# Altium project OGS_Headstage.PrjPcb
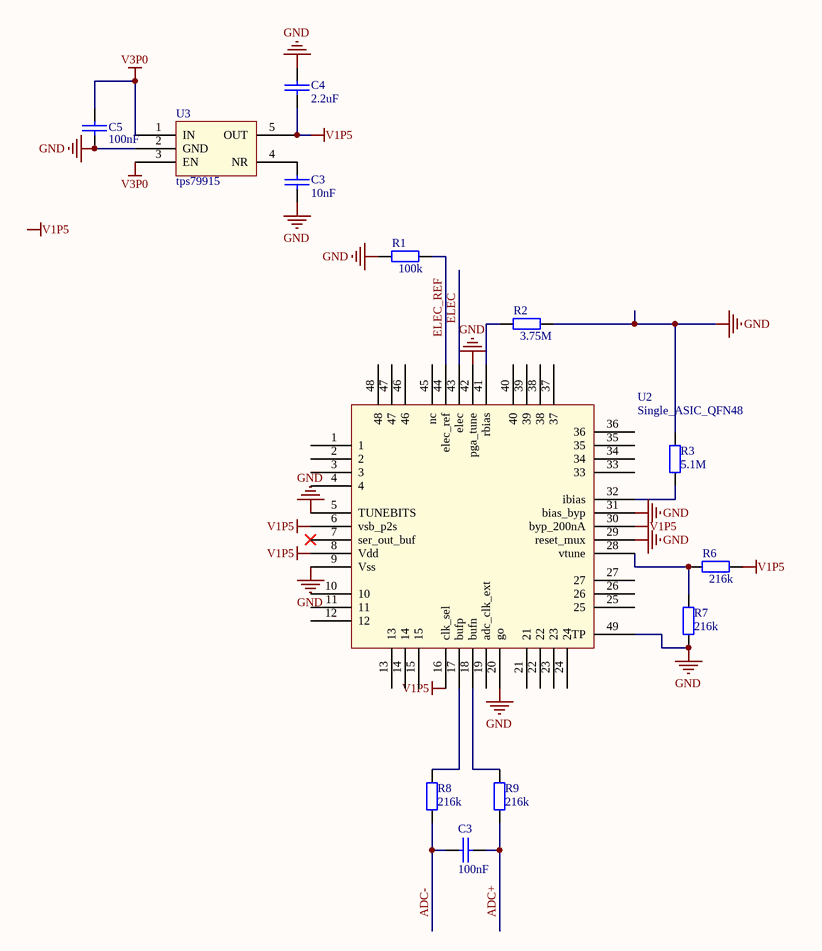
[diagram p0: SingleASIC.SchDoc]
4 sheets, 55 parts. Net scope: global (net labels, ports and power ports of the same name join across sheets).
Board file: OGS_Headstage.PcbDoc
Sheets:
  SingleASIC.SchDoc
  Main_4x4.SchDoc
  LED_SOP.SchDoc
  RF_POWER.SchDoc

## Sheet SingleASIC.SchDoc
size A

### Parts
(Parts that share a designator on the sheet are numbered #1, #2 ... from top to bottom, then left to right.)
C3#1  value 10nF  [0402s]  (hidden comment: NP0 50V)
C3#2  value 100nF  [0402s]  (hidden comment: NP0 50V)
C4#1  value 2.2uF  [0402s]  (hidden comment: NP0 50V)
C5#1  value 100nF  [0402s]  (hidden comment: NP0 50V)
R1  value 100k  [0402s]  (hidden comment: Res2)
R2  value 3.75M  [0402s]  (hidden comment: Res2)
R3  value 5.1M  [0402s]  (hidden comment: Res2)
R6  value 216k  [0402s]  (hidden comment: Res2)
R7  value 216k  [0402s]  (hidden comment: Res2)
R8  value 216k  [0402s]  (hidden comment: Res2)
R9  value 216k  [0402s]  (hidden comment: Res2)
U2  Single_ASIC_QFN48  [Single_ASIC]
U3#1  tps79915  [SOT23-5AN]

### Nets
GND: C3#1.1 C4#1.2 C5#1.1 R1.1 R2.2 R3.2 R7.1 U2.5(TUNEBITS) U2.9(Vss) U2.20(go) U2.29(reset_mux) U2.31(bias_byp) U2.42(pga_tune) U2.49(TP) U3#1.2(GND)
V1P5: C4#1.1 R6.2 U2.6(vsb_p2s) U2.8(Vdd) U2.16(clk_sel) U2.30(byp_200nA) U3#1.5(OUT)
V3P0: C5#1.2 U3#1.1(IN) U3#1.3(EN)
ADC+: C3#2.1 R9.1
ADC-: C3#2.2 R8.1
ELEC: U2.43(elec)
ELEC_REF: R1.2 U2.44(elec_ref)
NetC3#1_2: C3#1.2 U3#1.4(NR)
NetR2_1: R2.1 U2.41(rbias)
NetR3_1: R3.1 U2.32(ibias)
NetR6_1: R6.1 R7.2 U2.28(vtune)
NetR8_2: R8.2 U2.17(bufp)
NetR9_2: R9.2 U2.18(bufn)

Not connected (* = marked no-connect by the designer): U2 1 2 3 4 7(ser_out_buf)* 10 11 12 13 14 15 19(adc_clk_ext) 21 22 23 24 25 26 27 33 34 35 36 37 38 39 40 45(nc) 46 47 48

### Notes on the sheet
- Labels drawn without touching a wire or pin: V1P5

### Library data of the parts
C3#1 C3#2 C4#1 C5#1 = Cap: Capacitor; Part Field 1: 0402
R1-R3 R6-R9 = Res2: Resistor; Published: 8-Jun-2000; LatestRevisionDate: 17-Jul-2002; LatestRevisionNote: Re-released for DXP Platform.; PackageReference: AXIAL-0.4; Publisher: Altium Limited; PackageDescription: Axial Device, Thru-Hole; 2 Leads; 0.4 in Pin Spacing

## Sheet Main_4x4.SchDoc
size A
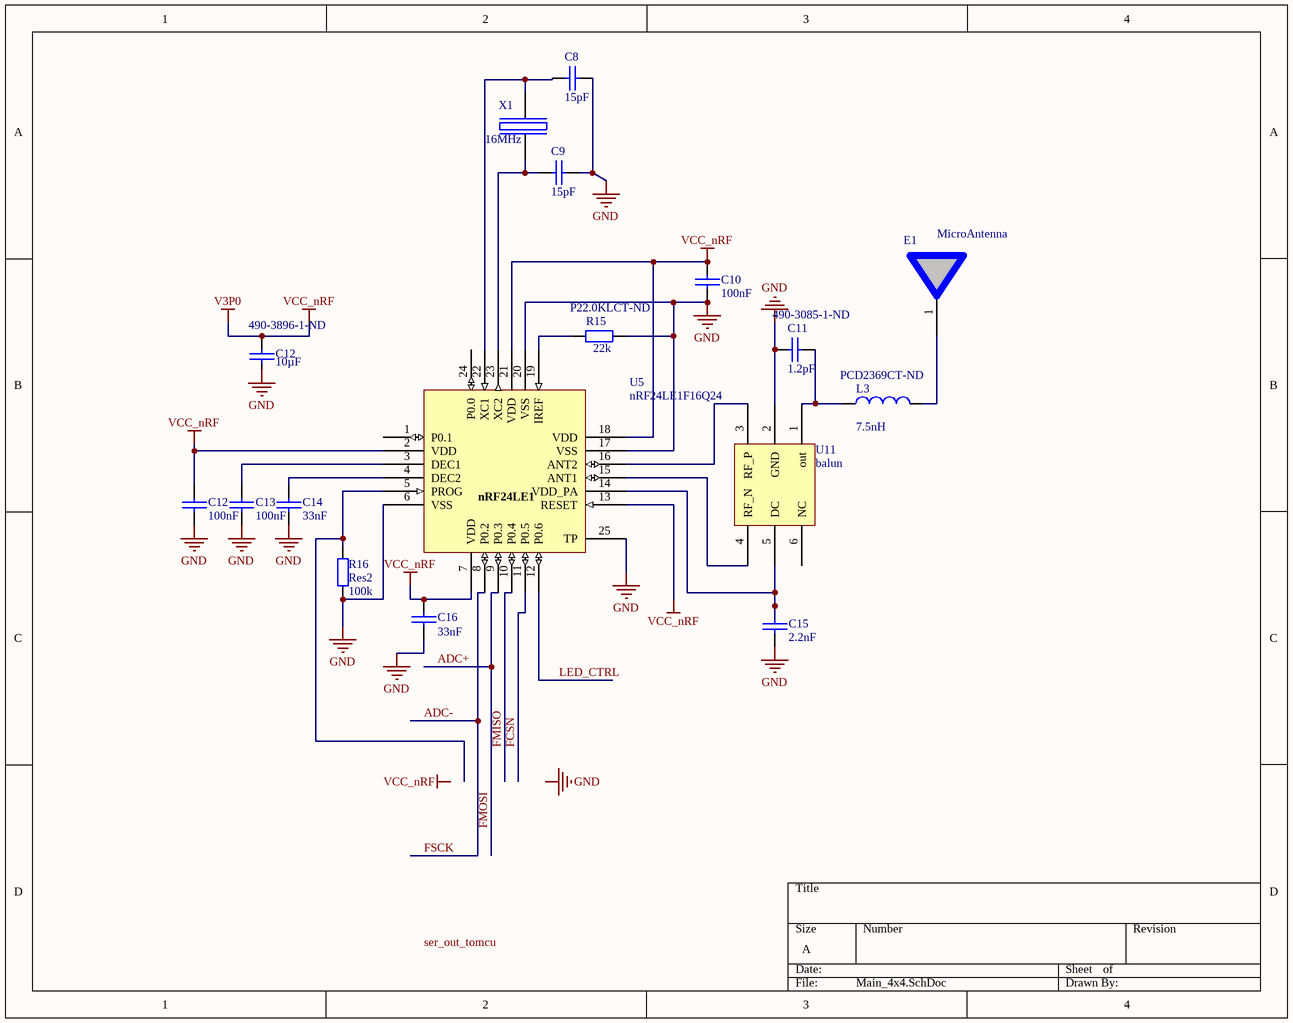
[diagram p1: Main_4x4.SchDoc]

### Parts
(Parts that share a designator on the sheet are numbered #1, #2 ... from top to bottom, then left to right.)
C8  value 15pF  [0402s]  (hidden comment: NP0 50V)
C9  value 15pF  [0402s]  (hidden comment: NP0 50V)
C10  value 100nF  [0402s]  (hidden comment: NP0 50V)
C11  value 1.2pF  Supplier Part Number 1: 490-3085-1-ND  [0402s]  (hidden comment: NP0 50V)
C12#1  Supplier Part Number 1: 490-3896-1-ND  Capacitance: 10µF  [0402s]  (hidden comment: NP0 50V)
C12#2  value 100nF  [0402s]  (hidden comment: NP0 50V)
C13  value 100nF  [0402s]  (hidden comment: NP0 50V)
C14  value 33nF  [0402s]  (hidden comment: NP0 50V)
C15  value 2.2nF  [0402s]  (hidden comment: NP0 50V)
C16  value 33nF  [0402s]  (hidden comment: NP0 50V)
E1#1  MicroAntenna  [microantenna]
L3  value 7.5nH  Supplier Part Number 1: PCD2369CT-ND  [0402-A]  (hidden comment: Inductor)
R15  value 22k  Supplier Part Number 1: P22.0KLCT-ND  [0402s]  (hidden comment: Res2)
R16  Res2  value 100k  [0402s]
U5  value nRF24LE1F16Q24  [NORDIC_QFN50P400X400X90-25N]  (hidden comment: QFN24 4x4 package)
U11  balun  [balun]
X1  value 16MHz  [bt-xtal 2.5 x 2 mm]  (hidden comment: TSX-3225, 16MHz, Cl=9pF, +/-10ppm)

### Nets
GND: C8.1 C9.2 C10.2 C11.1 C12#2.2 C13.1 C14.2 C15.2 C16.1 R15.2 R16.1 U5.6(VSS) U5.17(VSS) U5.20(VSS) U5.25(TP) U11.2(GND) X1.2(GND) X1.4(GND)
V3P0: C10.1 C12#1.1 C12#2.1 C16.2 U5.2(VDD) U5.7(VDD) U5.13(RESET) U5.18(VDD) U5.21(VDD)  [also labelled VCC_nRF]
ADC+: U5.9(P0.3)  [also labelled FMOSI]
ADC-: U5.8(P0.2)  [also labelled FSCK]
FCSN: U5.11(P0.5)
FMISO: U5.10(P0.4)
LED_CTRL: U5.12(P0.6)
NetC8_2: C8.2 U5.22(XC1) X1.3(out)
NetC9_1: C9.1 U5.23(XC2) X1.1(inp)
NetC11_2: C11.2 L3.1 U11.1(out)
NetC13_2: C13.2 U5.3(DEC1)
NetC14_1: C14.1 U5.4(DEC2)
NetC15_1: C15.1 U5.14(VDD_PA) U11.5(DC)
NetE1#1_1: E1#1.1 L3.2
NetR15_1: R15.1 U5.19(IREF)
NetR16_2: R16.2 U5.5(PROG)
NetU5_15: U5.15(ANT1) U11.4(RF_N)
NetU5_16: U5.16(ANT2) U11.3(RF_P)

Not connected (* = marked no-connect by the designer): C12#1 2; E1#1 2; U5 1(P0.1) 24(P0.0); U11 6(NC)

### Notes on the sheet
- Labels drawn without touching a wire or pin: GND, ser_out_tomcu, VCC_nRF
- (in symbol nRF24LE1 - 4x4) nRF24LE1

### Library data of the parts
C8-C10 C12#2 C13 C14 C16 = Cap: Capacitor; Part Field 1: 0402
C11 = Cap: Capacitor; Part Field 1: 0402; Manufacturer: Murata Electronics North America; Manufacturer Part Number: GJM1555C1H1R2CB01D; Description: CAP CERAMIC 1.2PF 50V C0G 0402; Tolerance: ±0.25pF; Temperature Coefficient: C0G, NP0; Supplier 1: Digi-Key; RoHS: RoHS Compliant; Category: Capacitors; Stock 1: 74898; Pricing 1: 1=0.23, 10=0.143, 50=0.0686, 100=0.0515, 250=0.0372, 500=0.02746, 1000=0.01859 (USD); Capacitance: 1.2pF; Voltage - Rated: 50V; Mounting Type: Surface Mount, MLCC; Operating Temperature: -55°C ~ 125°C; Applications: RF, Microwave, High Frequency; Ratings: -; Package / Case: 0402 (1005 Metric); Size / Dimension: 0.039" L x 0.020" W (1.00mm x 0.50mm); Height: -; Thickness: 0.022" (0.55mm); Lead Spacing: -; Features: High Q, Low Loss; Packaging: Cut Tape (CT); Lead Style: -; ComponentLink1URL: http://search.murata.co.jp/Ceramy/image/img/PDF/ENG/GJM1555C1H1R2CB01.pdf; ComponentLink1Description: http://search.murata.co.jp/Ceramy/image/img/PDF/ENG/GJM1555C1H1R2CB01.pdf
C12#1 = Cap: Capacitor; Part Field 1: 0402; Manufacturer: Murata Electronics North America; Manufacturer Part Number: GRM188R60J106ME47D; Value: 10uF; Description: CAP CER 10UF 6.3V X5R 0603; Voltage - Rated: 6.3V; Tolerance: ±20%; Temperature Coefficient: X5R; Supplier 1: Digi-Key; RoHS: RoHS Compliant; Category: Capacitors; Stock 1: 1364710; Pricing 1: 1=0.51, 10=0.398, 50=0.2624, 100=0.208, 250=0.15376, 500=0.1194, 1000=0.09407 (USD); Mounting Type: Surface Mount, MLCC; Operating Temperature: -55°C ~ 85°C; Applications: General Purpose; Ratings: -; Package / Case: 0603 (1608 Metric); Size / Dimension: 0.063" L x 0.031" W (1.60mm x 0.80mm); Height: -; Thickness: 0.035" (0.90mm); Lead Spacing: -; Features: -; Packaging: Cut Tape (CT); Lead Style: -; ComponentLink1URL: http://search.murata.co.jp/Ceramy/image/img/PDF/ENG/GRM188R60J106ME47.pdf; ComponentLink1Description: http://search.murata.co.jp/Ceramy/image/img/PDF/ENG/GRM188R60J106ME47.pdf
C15 = Cap: Capacitor; Part Field 1: 0402; Manufacturer: Johanson Dielectrics Inc; Manufacturer Part Number: 500R07W222KV4T; Description: CAP CER 2200PF 50V X7R 0402; Capacitance: 2200pF; Tolerance: ±10%; Temperature Coefficient: X7R; Supplier 1: Digi-Key; Supplier Part Number 1: 709-1135-1-ND; RoHS: RoHS Compliant; Category: Capacitors; Stock 1: 33069; Pricing 1: 10=0.029, 100=0.0169, 500=0.00976, 1000=0.00676 (USD); Voltage - Rated: 50V; Mounting Type: Surface Mount, MLCC; Operating Temperature: -55°C ~ 125°C; Applications: General Purpose; Ratings: -; Package / Case: 0402 (1005 Metric); Size / Dimension: 0.040" L x 0.020" W (1.02mm x 0.51mm); Height: -; Thickness: 0.025" (0.64mm); Lead Spacing: -; Features: -; Packaging: Cut Tape (CT); Lead Style: -; ComponentLink1URL: http://www.johansondielectrics.com/images/stories/surface-mount/smt-mlc/JDI_Surface-Mount_2008-11.pdf; ComponentLink1Description: http://www.johansondielectrics.com/images/stories/surface-mount/smt-mlc/JDI_Surface-Mount_2008-11.pdf
L3 = Inductor: Manufacturer: Panasonic - ECG; Manufacturer Part Number: ELJ-RF7N5ZFB; Code_IEC: 1005; Description: INDUCTOR 7.5NH +/-.2NH 0402 SMD; Current: 320mA; Type: Non-Magnetic Core; Tolerance: ±0.2nH; DC Resistance (DCR): 330 mOhm Max; Q @ Freq: 8 @ 100MHz; Self Resonant Freq: 3.7GHz; Frequency - Test: 100MHz; Published: 8-Jun-2000; LatestRevisionDate: 29-May-2009; LatestRevisionNote: IPC-7351 Footprint Added.; PackageReference: 0402-A; Publisher: Altium Limited; PackageDescription: Chip Inductor; Code_JEITA: 0402; Supplier 1: Digi-Key; RoHS: RoHS Compliant; Category: Inductors, Coils, Chokes; Stock 1: 19666; Pricing 1: 1=0.08, 50=0.0786, 100=0.0593, 500=0.05446, 1000=0.04356 (USD); Inductance: 7.5nH; Current - Saturation: -; Current - Temperature Rise: -; Shielding: -; Package / Case: 0402 (1005 Metric); Mounting Type: Surface Mount; Packaging: Cut Tape (CT); Operating Temperature: -20°C ~ 85°C; Material - Core: -; Applications: High Frequency; ComponentLink1URL: http://industrial.panasonic.com/www-cgi/jvcr13pz.cgi?E+PZ+3+AGA0024+ELJRF7N5ZFB+7+WW; ComponentLink1Description: http://industrial.panasonic.com/www-cgi/jvcr13pz.cgi?E+PZ+3+AGA0024+ELJRF7N5ZFB+7+WW
R15 = Res2: Resistor; Manufacturer: Panasonic - ECG; Manufacturer Part Number: ERJ-2RKF2202X; Description: RES 22.0K OHM 1/10W 1% 0402 SMD; Power (Watts): 0.1W, 1/10W; Temperature Coefficient: ±100ppm/°C; Tolerance: ±1%; Published: 8-Jun-2000; LatestRevisionDate: 17-Jul-2002; LatestRevisionNote: Re-released for DXP Platform.; PackageReference: AXIAL-0.4; Publisher: Altium Limited; PackageDescription: Axial Device, Thru-Hole; 2 Leads; 0.4 in Pin Spacing; Supplier 1: Digi-Key; RoHS: RoHS Compliant; Category: Resistors; Stock 1: 495835; Pricing 1: 1=0.06, 50=0.0242, 100=0.0184, 250=0.01364, 500=0.01008, 1000=0.00672, 5000=0.00473 (USD); Resistance (Ohms): 22K; Composition: Thick Film; Features: -; Size / Dimension: 0.039" L x 0.020" W (1.00mm x 0.50mm); Height: 0.014" (0.35mm); Number of Terminations: 2; Packaging: Cut Tape (CT); Package / Case: 0402 (1005 Metric); ComponentLink1URL: http://industrial.panasonic.com/www-cgi/jvcr13pz.cgi?E+PZ+3+AOA0002+ERJ2RKF2202X+7+WW; ComponentLink1Description: http://industrial.panasonic.com/www-cgi/jvcr13pz.cgi?E+PZ+3+AOA0002+ERJ2RKF2202X+7+WW
R16 = Res2: Resistor; Published: 8-Jun-2000; LatestRevisionDate: 17-Jul-2002; LatestRevisionNote: Re-released for DXP Platform.; PackageReference: AXIAL-0.4; Publisher: Altium Limited; PackageDescription: Axial Device, Thru-Hole; 2 Leads; 0.4 in Pin Spacing
U5 = nRF24LE1 - 4x4: 2.4GHz Tranceiver with embedded MCU and 10 bit ADC
X1 = BT-XTAL: Crystal; Manufacturer: NDK; Manufacturer Part Number: NX2520SA-16.000000MHZ; Description: CRYSTAL 16.000000 MHZ 10PF SMD; Frequency Stability: ±10ppm; Load Capacitance: 10pF; Operating Mode: Fundamental; Supplier 1: Digi-Key; Supplier Part Number 1: 644-1059-1-ND; RoHS: RoHS Compliant; Category: Crystals and Oscillators; Stock 1: 12667; Pricing 1: 1=2.12, 10=1.839, 50=1.6128, 100=1.2733, 500=1.07524, 750=0.93943, 1000=0.84888 (USD); Type: MHz Crystal; Frequency: 16MHz; Frequency Tolerance: ±10ppm; Operating Temperature: -10°C ~ 60°C; Mounting Type: Surface Mount; Package / Case: 4-SMD, No Lead (DFN, LCC); Size / Dimension: 0.098" L x 0.079" W (2.50mm x 2.00mm); Height: 0.026" (0.65mm); Packaging: Cut Tape (CT); ComponentLink1URL: http://media.digikey.com/pdf/Data%20Sheets/NDK%20PDFs/NX2520SA.pdf; ComponentLink1Description: http://media.digikey.com/pdf/Data%20Sheets/NDK%20PDFs/NX2520SA.pdf

## Sheet LED_SOP.SchDoc
size A
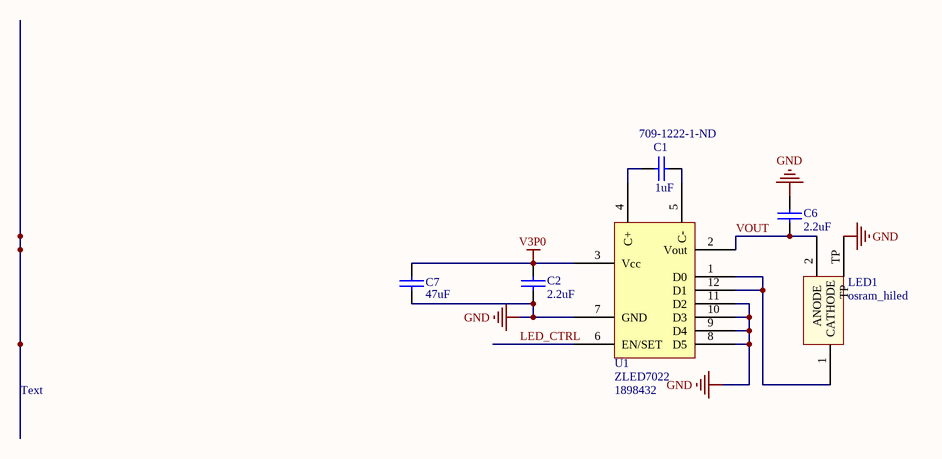
[diagram p2: LED_SOP.SchDoc]

### Parts
C1  value 1uF  Supplier Part Number 1: 709-1222-1-ND  [0402s]  (hidden comment: NP0 50V)
C2  value 2.2uF  [0402s]  (hidden comment: NP0 50V)
C6  value 2.2uF  [0402s]  (hidden comment: NP0 50V)
C7  value 47uF  [0402s]  (hidden comment: NP0 50V)
LED1  osram_hiled  [LUXEON LED]
U1  ZLED7022  Supplier Part Number 1: 1898432  [12utqfn]

### Nets
GND: C2.1 C6.2 C7.1 LED1.TP U1.7(GND) U1.8(D5) U1.9(D4) U1.10(D3) U1.11(D2)
V3P0: C2.2 C7.2 U1.3(Vcc)
LED_CTRL: U1.6(EN/SET)
VOUT: C6.1 LED1.2(ANODE) U1.2(Vout)
NetC1_1: C1.1 U1.4(C+)
NetC1_2: C1.2 U1.5(C-)
NetLED1_1: LED1.1(CATHODE) U1.1(D0) U1.12(D1)

### Notes on the sheet
- Text

### Library data of the parts
C1 = Cap: Capacitor; Part Field 1: 0402; Manufacturer: Johanson Dielectrics Inc; Manufacturer Part Number: 100R07X105KV4T; Description: CAP CER 1UF 10V X5R 0402; Capacitance: 1.0µF; Voltage - Rated: 10V; Tolerance: ±10%; Temperature Coefficient: X5R; Supplier 1: Digi-Key; RoHS: RoHS Compliant; Category: Capacitors; Stock 1: 22620; Pricing 1: 10=0.146, 100=0.0861, 500=0.04968, 1000=0.03445 (USD); Mounting Type: Surface Mount, MLCC; Operating Temperature: -55°C ~ 85°C; Applications: SMPS Filtering; Ratings: -; Package / Case: 0402 (1005 Metric); Size / Dimension: 0.040" L x 0.020" W (1.02mm x 0.51mm); Height: -; Thickness: 0.025" (0.64mm); Lead Spacing: -; Features: -; Packaging: Cut Tape (CT); Lead Style: -; ComponentLink1URL: http://www.johansondielectrics.com/images/stories/surface-mount/tanceram/JDI_Tanceram_2010-03.pdf; ComponentLink1Description: http://www.johansondielectrics.com/images/stories/surface-mount/tanceram/JDI_Tanceram_2010-03.pdf
C2 C6 C7 = Cap: Capacitor; Part Field 1: 0402
U1 = ZLED7022: ZLED 7022; Manufacturer: ZMDI; Manufacturer Part Number: ZLED7022-ZI1R; Description: ZMDI - ZLED7022-ZI1R - LED DRIVER, 6CH, 20MA, UTQFN12; LED Driver Application: Cell Phones, PDA; No. of Outputs: 1; Output Current: 20; Input Voltage: 2.8V to 5.5; Driver Case Style: UTQFN; No. of Pins: 12; Supplier 1: Farnell; RoHS: YES; Category: Semiconductors - ICs; Stock 1: 99; Pricing 1: 1=1.39, 10=0.99, 100=0.77, 250=0.7, 500=0.58 (GBP); Operating Temperature Range: -40°C to +85; Switching Frequency: 1; ComponentLink1URL: http://www.zmdi.com/products/led-drivers/zled7022/; ComponentLink1Description: http://www.zmdi.com/products/led-drivers/zled7022/; ComponentLink2URL: http://www.farnell.com/datasheets/1340041.pdf; ComponentLink2Description: http://www.farnell.com/datasheets/1340041.pdf

## Sheet RF_POWER.SchDoc
size A
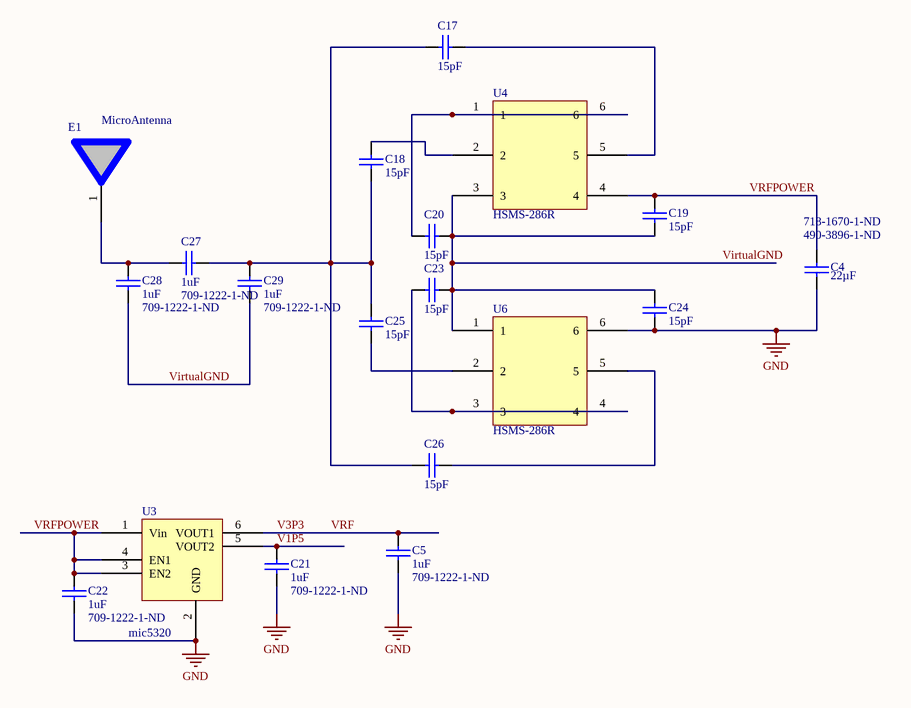
[diagram p3: RF_POWER.SchDoc]

### Parts
(Parts that share a designator on the sheet are numbered #1, #2 ... from top to bottom, then left to right.)
C4#2  Supplier Part Number 1: 490-3896-1-ND  Capacitance: 22µF  Supplier Part Number 2: 718-1670-1-ND  [1608[0603]]  (hidden comment: NP0 50V)
C5#2  value 1uF  Supplier Part Number 1: 709-1222-1-ND  [0402l]  (hidden comment: NP0 50V)
C17  value 15pF  [0201]  (hidden comment: NP0 50V)
C18  value 15pF  [0201]  (hidden comment: NP0 50V)
C19  value 15pF  [0201]  (hidden comment: NP0 50V)
C20  value 15pF  [0201]  (hidden comment: NP0 50V)
C21  value 1uF  Supplier Part Number 1: 709-1222-1-ND  [0402l]  (hidden comment: NP0 50V)
C22  value 1uF  Supplier Part Number 1: 709-1222-1-ND  [0402l]  (hidden comment: NP0 50V)
C23  value 15pF  [0201]  (hidden comment: NP0 50V)
C24  value 15pF  [0201]  (hidden comment: NP0 50V)
C25  value 15pF  [0201]  (hidden comment: NP0 50V)
C26  value 15pF  [0201]  (hidden comment: NP0 50V)
C27  value 1uF  Supplier Part Number 1: 709-1222-1-ND  [0402l]  (hidden comment: NP0 50V)
C28  value 1uF  Supplier Part Number 1: 709-1222-1-ND  [0402l]  (hidden comment: NP0 50V)
C29  value 1uF  Supplier Part Number 1: 709-1222-1-ND  [0402l]  (hidden comment: NP0 50V)
E1#2  MicroAntenna  [2450AT18B100]
U3#2  mic5320  [MLF-6]
U4  HSMS-286R  [SOT363-6M]
U6  HSMS-286R  [SOT363-6M]

### Nets
GND: C4#2.2 C5#2.2 C21.2 C22.2 C24.1 U3#2.2(GND) U6.6
V1P5: C21.1 U3#2.5(VOUT2)
V3P3: C5#2.1 U3#2.6(VOUT1)  [also labelled VRF]
VirtualGND: C19.2 C20.1 C23.1 C24.2 C28.2 C29.2 U4.3 U6.1
VRFPOWER: C4#2.1 C19.1 C22.1 U3#2.1(Vin) U3#2.3(EN2) U3#2.4(EN1) U4.4
NetC17_1: C17.1 U4.5
NetC17_2: C17.2 C18.1 C25.2 C26.2 C27.1 C29.1
NetC18_2: C18.2 U4.2
NetC20_2: C20.2 U4.1 U4.6
NetC23_2: C23.2 U6.3 U6.4
NetC25_1: C25.1 U6.2
NetC26_1: C26.1 U6.5
NetC27_2: C27.2 C28.1 E1#2.1

Not connected (* = marked no-connect by the designer): E1#2 2

### Library data of the parts
C4#2 = Cap: Capacitor; Part Field 1: 0402; Manufacturer: Murata Electronics North America; Manufacturer Part Number: GRM188R60J106ME47D; Manufacturer Size Code: M; Value: 10uF; Description: CAP CER 10UF 6.3V X5R 0603; Voltage - Rated: 6.3V; Tolerance: ±20%; Temperature Coefficient: X5R; ESR (Equivalent Series Resistance): 1.500 Ohm; Type: Molded; Supplier 1: Digi-Key; RoHS: RoHS Compliant; Category: Capacitors; Stock 1: 1364710; Pricing 1: 1=0.51, 10=0.398, 50=0.2624, 100=0.208, 250=0.15376, 500=0.1194, 1000=0.09407 (USD); Mounting Type: Surface Mount, MLCC; Operating Temperature: -55°C ~ 85°C; Applications: General Purpose; Ratings: -; Package / Case: 0603 (1608 Metric); Size / Dimension: 0.063" L x 0.031" W (1.60mm x 0.80mm); Height: -; Thickness: 0.035" (0.90mm); Lead Spacing: -; Features: -; Packaging: Cut Tape (CT); Lead Style: -; ComponentLink1URL: http://search.murata.co.jp/Ceramy/image/img/PDF/ENG/GRM188R60J106ME47.pdf; ComponentLink1Description: http://search.murata.co.jp/Ceramy/image/img/PDF/ENG/GRM188R60J106ME47.pdf; Supplier 2: Digi-Key; Stock 2: 12402; Pricing 2: 1=2.15, 10=1.785, 100=1.575, 250=1.47, 500=1.3125, 1000=1.05 (USD); Height - Seated (Max): 0.035" (0.89mm); Lifetime @ Temp.: -; ComponentLink2URL: http://www.vishay.com/docs/40114/tr8.pdf; ComponentLink2Description: http://www.vishay.com/docs/40114/tr8.pdf
C5#2 C21 C22 C27-C29 = Cap: as C1 on sheet LED_SOP; Supplier 1: Digi-Key; RoHS: RoHS Compliant; Category: Capacitors; Stock 1: 22620; Pricing 1: 10=0.146, 100=0.0861, 500=0.04968, 1000=0.03445 (USD); Mounting Type: Surface Mount, MLCC; Operating Temperature: -55°C ~ 85°C; Applications: SMPS Filtering; Ratings: -; Package / Case: 0402 (1005 Metric); Size / Dimension: 0.040" L x 0.020" W (1.02mm x 0.51mm); Height: -; Thickness: 0.025" (0.64mm); Lead Spacing: -; Features: -; Packaging: Cut Tape (CT); Lead Style: -; ComponentLink1URL: http://www.johansondielectrics.com/images/stories/surface-mount/tanceram/JDI_Tanceram_2010-03.pdf; ComponentLink1Description: http://www.johansondielectrics.com/images/stories/surface-mount/tanceram/JDI_Tanceram_2010-03.pdf
C17-C20 C23-C26 = Cap: Capacitor; Part Field 1: 0201

## Nets that join several sheets
GND: SingleASIC (15 pins), Main_4x4 (18 pins), LED_SOP (9 pins), RF_POWER (7 pins)
V1P5: SingleASIC (7 pins), RF_POWER (C21.1 U3#2.5)
V3P0: SingleASIC (C5#1.2 U3#1.1 U3#1.3), Main_4x4 (9 pins), LED_SOP (C2.2 C7.2 U1.3)
ADC+: SingleASIC (C3#2.1 R9.1), Main_4x4 (U5.9)
ADC-: SingleASIC (C3#2.2 R8.1), Main_4x4 (U5.8)
LED_CTRL: Main_4x4 (U5.12), LED_SOP (U1.6)